# Altium schematic sheet 0179_EDP POWER GENERATI.SchDoc
size 848 x 558 mm
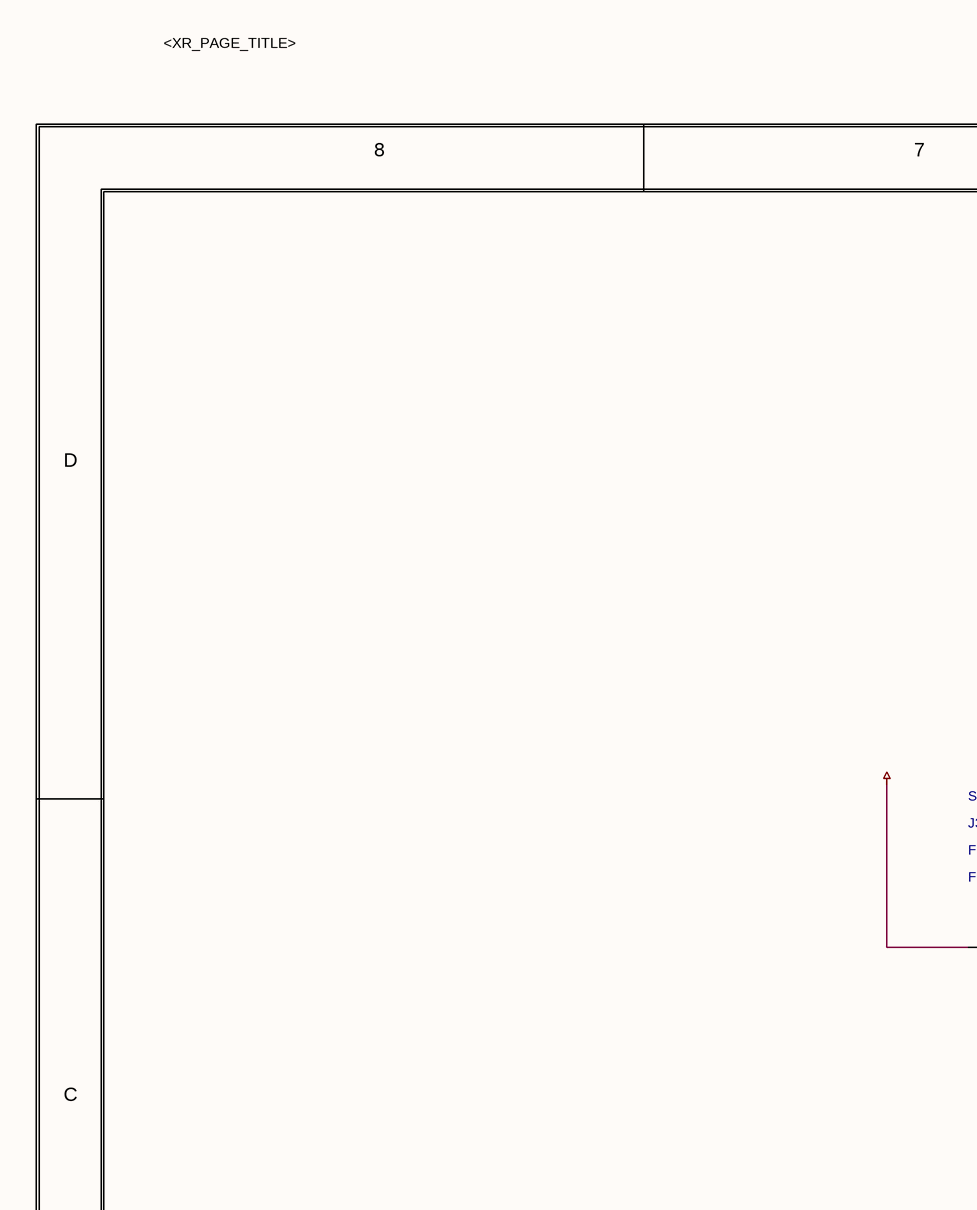
[diagram p0: 0179_EDP POWER GENERATI.SchDoc, top left]
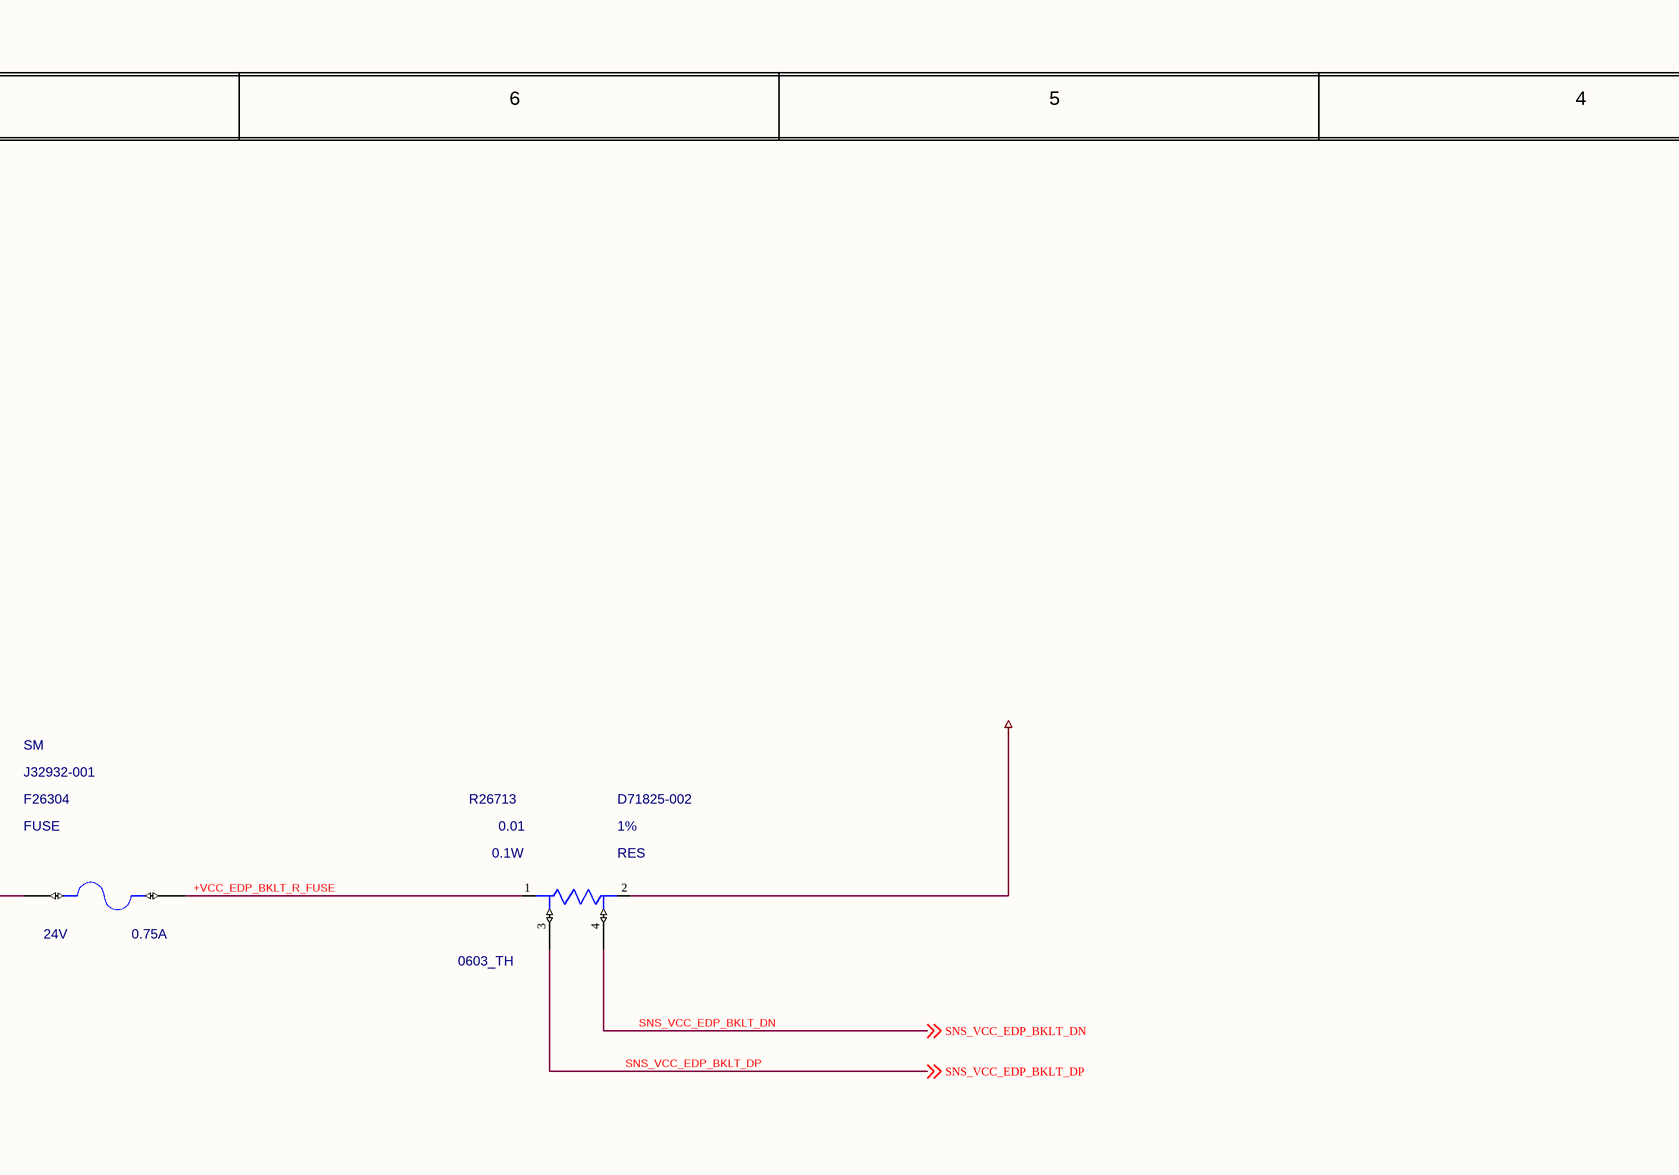
[diagram p1: 0179_EDP POWER GENERATI.SchDoc, top middle]
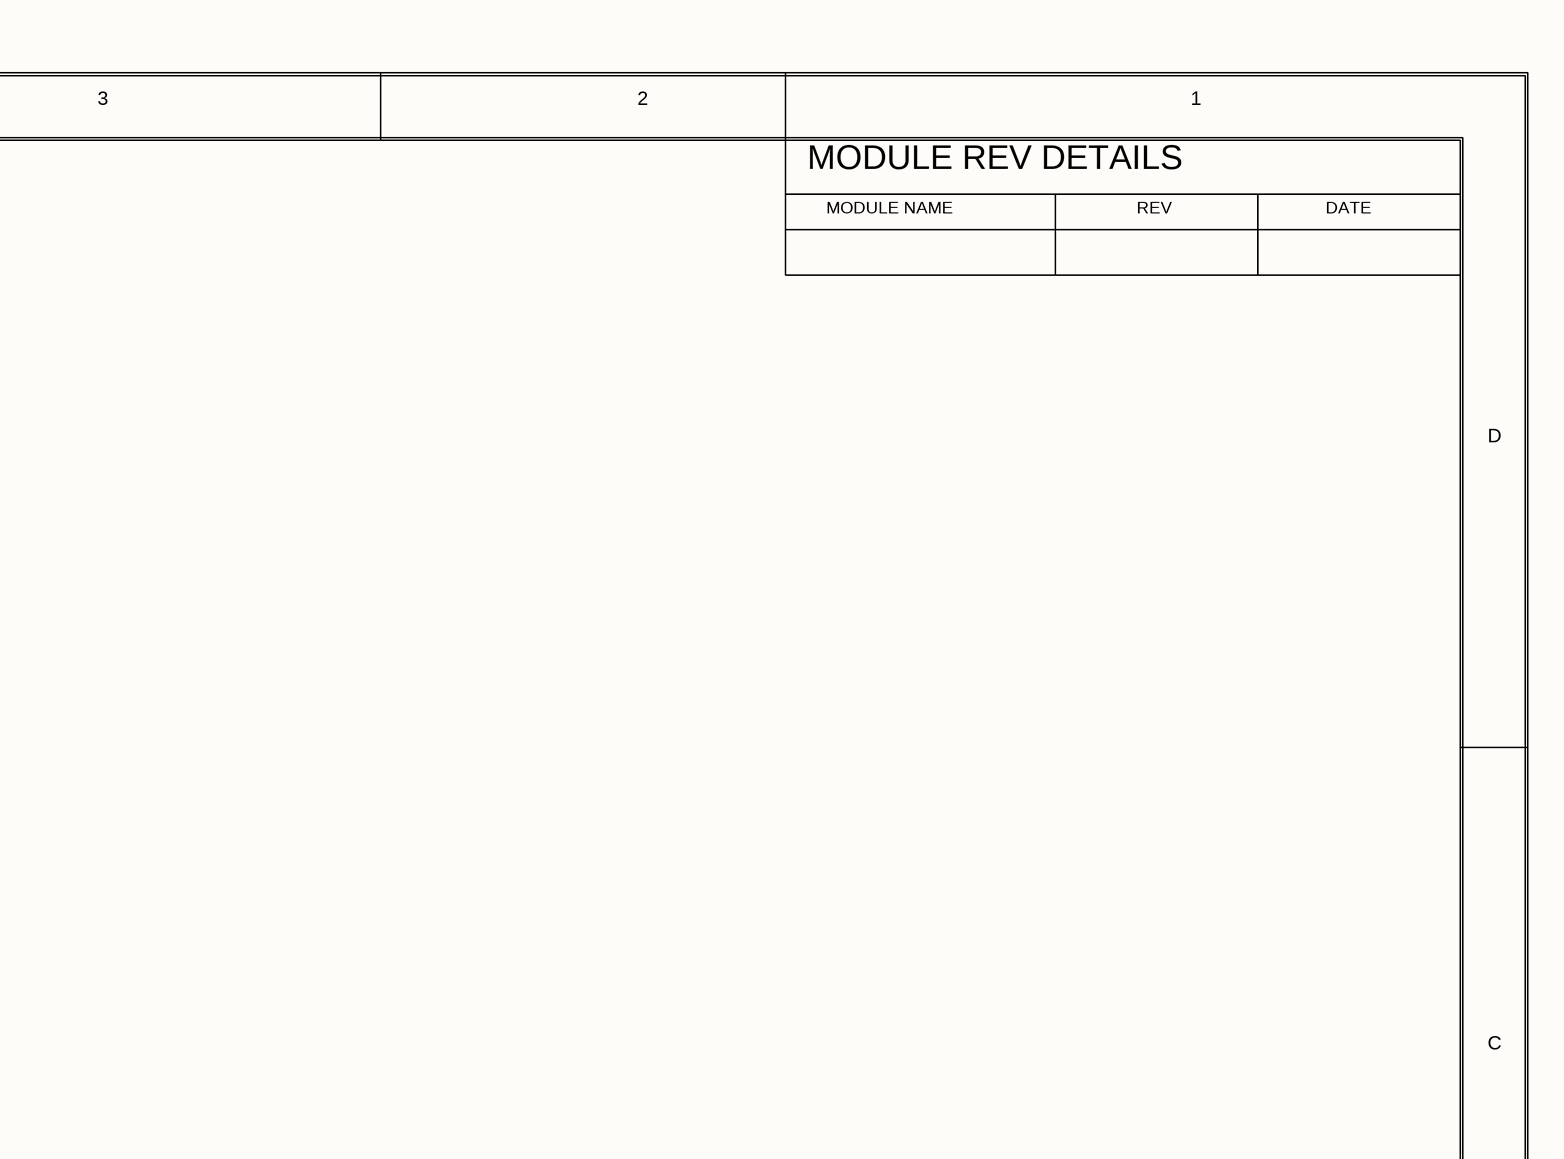
[diagram p2: 0179_EDP POWER GENERATI.SchDoc, top right]
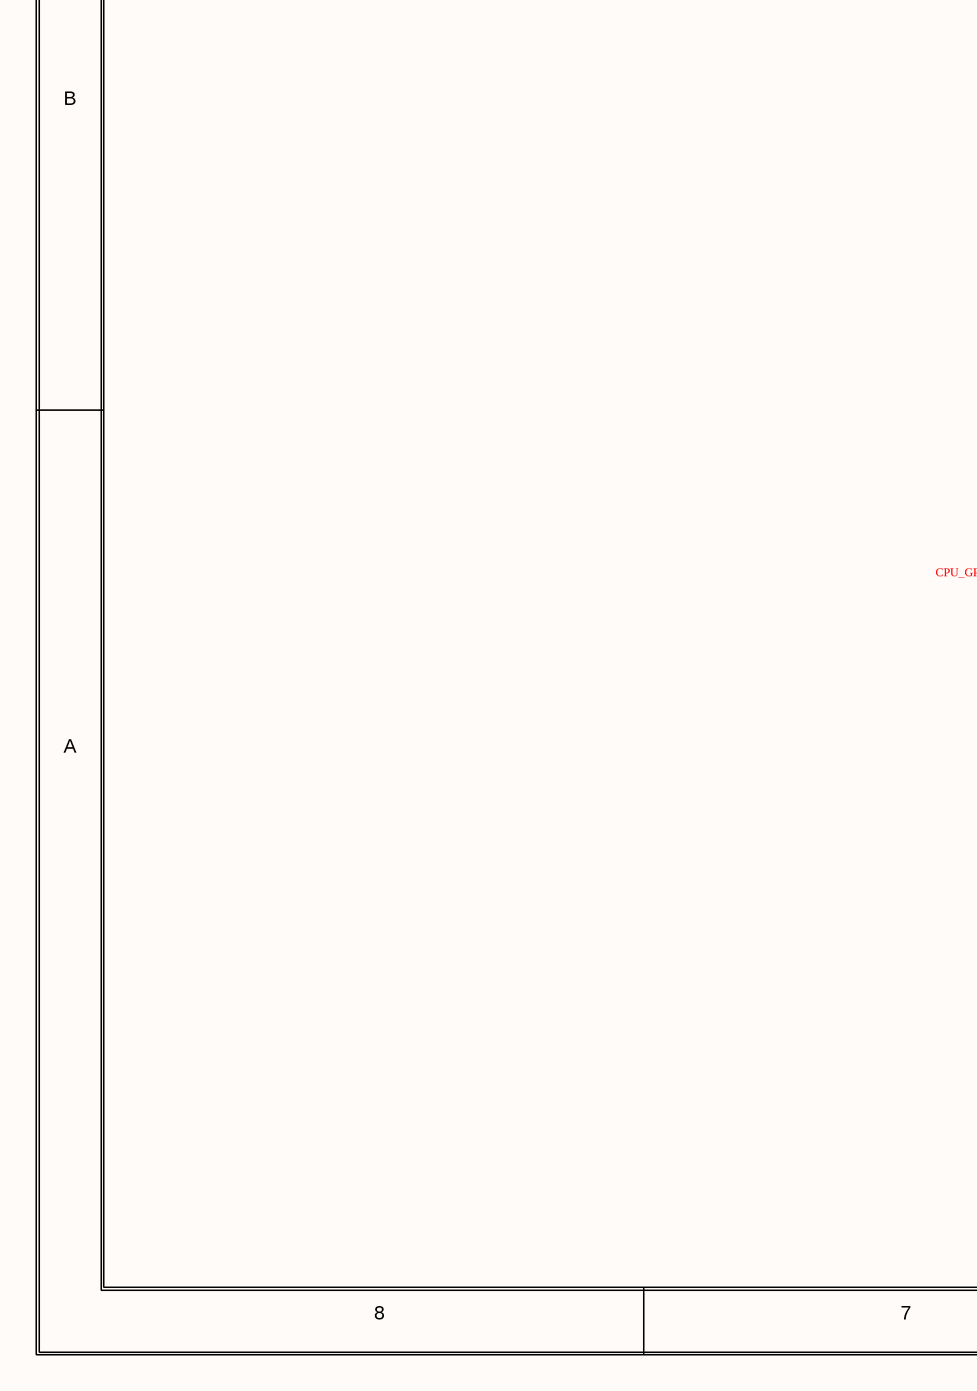
[diagram p3: 0179_EDP POWER GENERATI.SchDoc, bottom left]
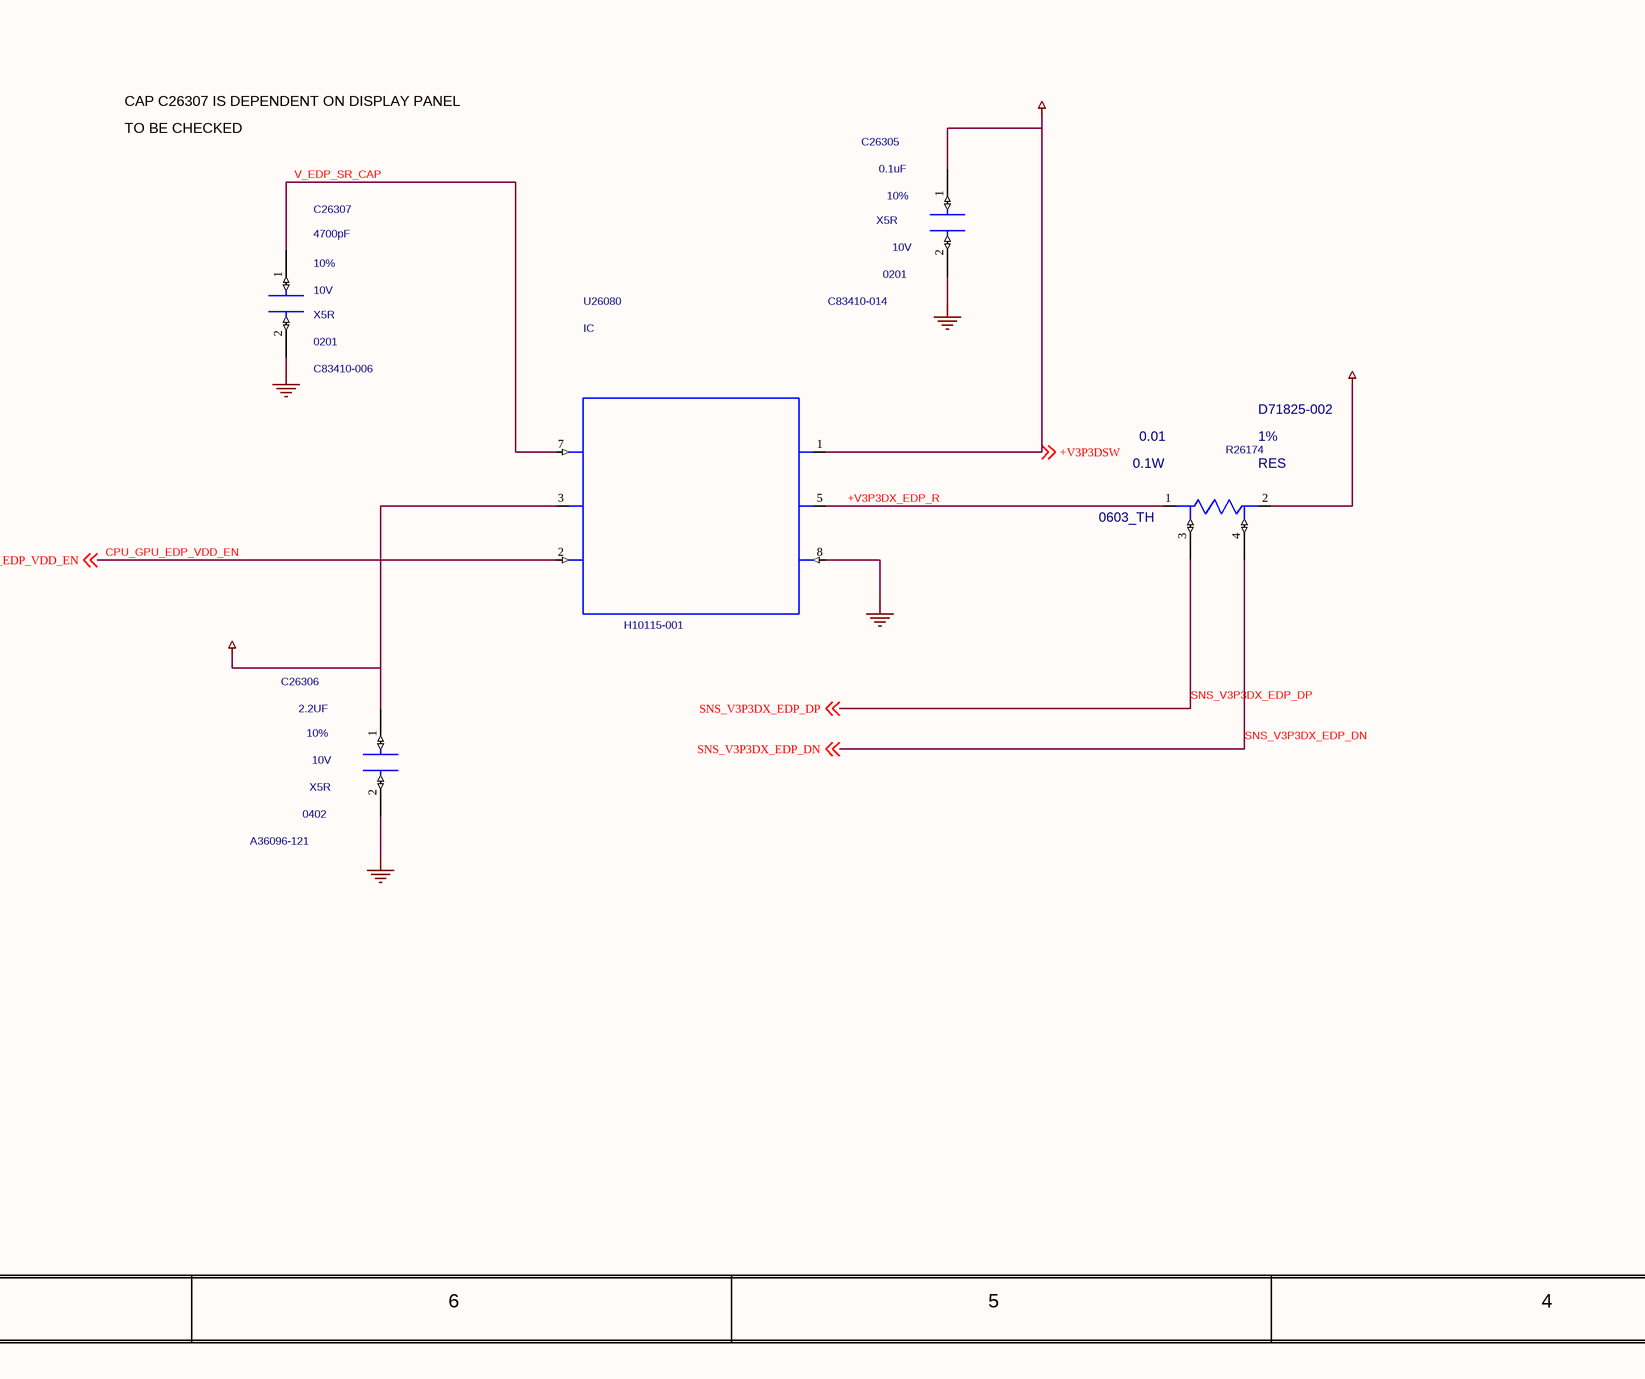
[diagram p4: 0179_EDP POWER GENERATI.SchDoc, bottom middle]
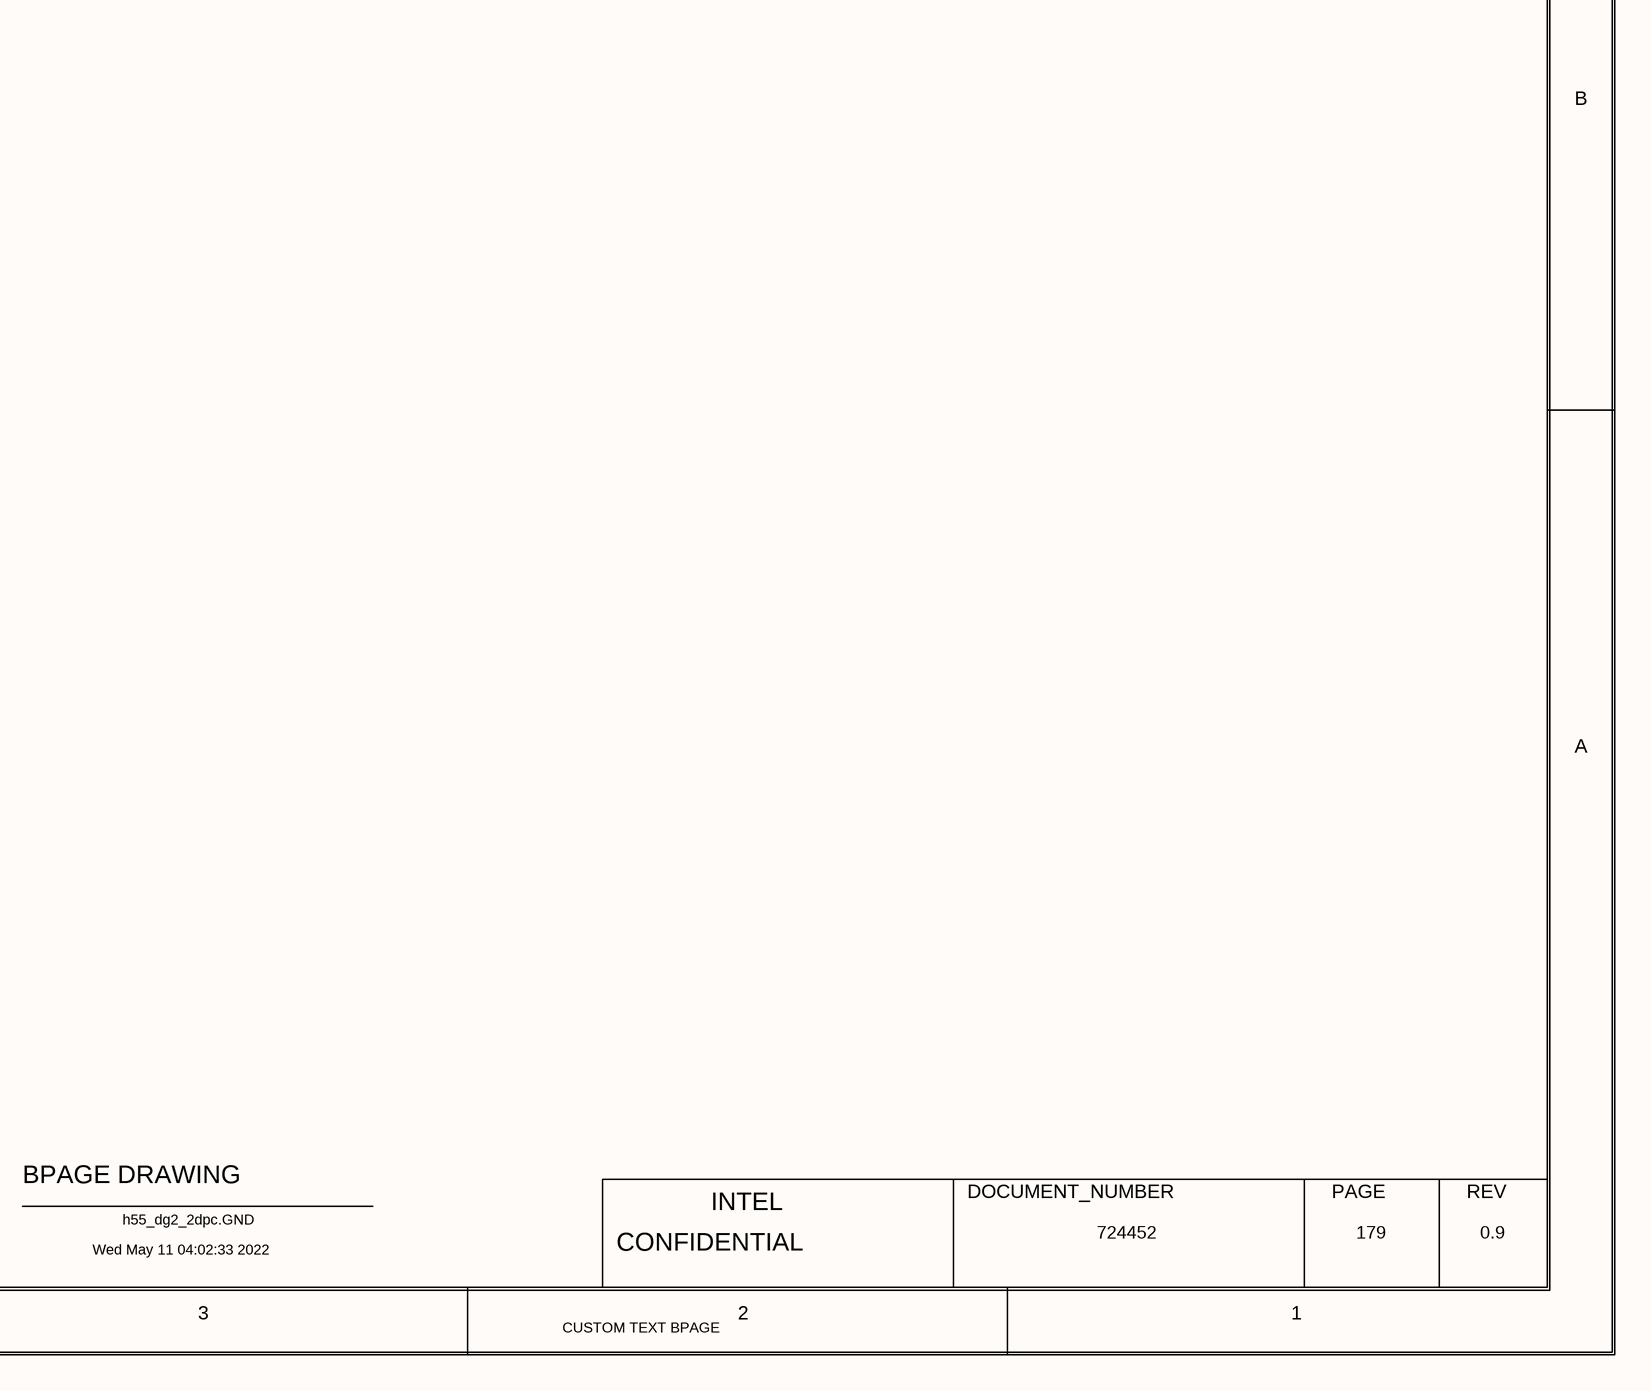
[diagram p5: 0179_EDP POWER GENERATI.SchDoc, bottom right]

## Parts
C26305  0.1uF  MATERIAL: X5R  PACK_TYPE: 0201  PART_NUMBER: C83410-014  TOLERANCE: 10%  VOLTAGE: 10V  [SMC0201IA]
C26306  2.2UF  MATERIAL: X5R  PACK_TYPE: 0402  PART_NUMBER: A36096-121  TOLERANCE: 10%  VOLTAGE: 10V  [SMC0402IA]
C26307  4700pF  MATERIAL: X5R  PACK_TYPE: 0201  PART_NUMBER: C83410-006  TOLERANCE: 10%  VOLTAGE: 10V  [SMC0201IA]
F26304  CURRENT: 0.75A  PACK_TYPE: SM  PART_NUMBER: J32932-001  VOLTAGE: 24V  [SFU3225MA]  (hidden comment: FUSE)
R26174  0.01  MATERIAL: RES  PACK_TYPE: 0603_TH  PART_NUMBER: D71825-002  TOLERANCE: 1%  WATTAGE: 0.1W  [CTK0_SMR4_0603_1800X1014_MA]
R26713  0.01  MATERIAL: RES  PACK_TYPE: 0603_TH  PART_NUMBER: D71825-002  TOLERANCE: 1%  WATTAGE: 0.1W  [CTK0_SMR4_0603_1800X1014_MA]
U26080  MATERIAL: IC  PART_NUMBER: H10115-001  [CTK1_LCC8_1050X1650_400_MA]  (hidden comment: C_SLG5NT1458V)

## Nets
+V3P3DSW: C26305.1(A) C26306.1(A) U26080.1(VDD) U26080.3(D) ; off-sheet +V3P3DSW
+V3P3DX_EDP: R26174.2(PWRB)
+VBATA: F26304.1(A)
+VCC_EDP_BKLT: R26713.2(PWRB)
GND: C26305.2(B) C26306.2(B) C26307.2(B) U26080.8(GND)
+V3P3DX_EDP_R: R26174.1(PWRA) U26080.5(S)
+VCC_EDP_BKLT_R_FUSE: F26304.2(B) R26713.1(PWRA)
CPU_GPU_EDP_VDD_EN: U26080.2(ON) ; off-sheet CPU_GPU_EDP_VDD_EN
SNS_V3P3DX_EDP_DN: R26174.4(SENB) ; off-sheet SNS_V3P3DX_EDP_DN
SNS_V3P3DX_EDP_DP: R26174.3(SENA) ; off-sheet SNS_V3P3DX_EDP_DP
SNS_VCC_EDP_BKLT_DN: R26713.4(SENB) ; off-sheet SNS_VCC_EDP_BKLT_DN
SNS_VCC_EDP_BKLT_DP: R26713.3(SENA) ; off-sheet SNS_VCC_EDP_BKLT_DP
V_EDP_SR_CAP: C26307.1(A) U26080.7(CAP)

## Notes on the sheet
- <XR_PAGE_TITLE>
- 8
- 7
- 6
- 5
- 4
- 3
- 2
- 1
- MODULE REV DETAILS
- MODULE NAME
- REV
- DATE
- D
- C
- B
- CAP C26307 IS DEPENDENT ON DISPLAY PANEL
- TO BE CHECKED
- A
- BPAGE DRAWING
- INTEL
- DOCUMENT_NUMBER
- PAGE
- Wed May 11 04:02:33 2022
- h55_dg2_2dpc.GND
- CONFIDENTIAL
- 724452
- 179
- 0.9
- CUSTOM TEXT BPAGE

## Library data of the parts
C26305 = CAP: CDS_PHYS_PART_NAME: CAP_0201-C83410-014,X5R,0.1UF,10V,10%,LPDB,GENERIC; OriginalSymbolOrigin: (-50,25); XY: (7700,1450); VER: 1; SUB_ROOM_2: DECOUPLING; SUB_ROOM_1: V3P3DX_EDP; ROT: 2; PHYS_PAGE: 179; LOCATION: C26305; DRAWING: @RVP1_ADL_SB_ADP_S_DDR5_SODIMM_2DPC_LIB.H55_DG2_2DPC(SCH_1):PAGE548; CDS_LIB: discrete; PCB Footprint: SMC0201IA; CHIPS_PART_NAME: CAP; CDS_PART_NAME: CAP_0201-C83410-014,X5R,0.1UF,10V,10%,LPDB,GENERIC; CDS_LOCATION: C26305
C26306 = CAP: CDS_PHYS_PART_NAME: CAP_0402-A36096-121,X5R,2.2UF,10V,10%,LPDB,GENERIC; OriginalSymbolOrigin: (-50,25); XY: (6650,450); VER: 1; SUB_ROOM_2: DECOUPLING; SUB_ROOM_1: V3P3DX_EDP; ROT: 2; PHYS_PAGE: 179; LOCATION: C26306; DRAWING: @RVP1_ADL_SB_ADP_S_DDR5_SODIMM_2DPC_LIB.H55_DG2_2DPC(SCH_1):PAGE548; CDS_LIB: discrete; PCB Footprint: SMC0402IA; CHIPS_PART_NAME: CAP; CDS_PART_NAME: CAP_0402-A36096-121,X5R,2.2UF,10V,10%,LPDB,GENERIC; CDS_LOCATION: C26306
C26307 = CAP: CDS_PHYS_PART_NAME: CAP_0201-C83410-006,X5R,4700PF,10V,10%,LPDB,GENERIC; OriginalSymbolOrigin: (-50,25); XY: (6475,1300); VER: 1; SUB_ROOM_2: MISC; SUB_ROOM_1: V3P3DX_EDP; ROT: 0; PHYS_PAGE: 179; LOCATION: C26307; DRAWING: @RVP1_ADL_SB_ADP_S_DDR5_SODIMM_2DPC_LIB.H55_DG2_2DPC(SCH_1):PAGE548; CDS_LIB: discrete; PCB Footprint: SMC0201IA; CHIPS_PART_NAME: CAP; CDS_PART_NAME: CAP_0201-C83410-006,X5R,4700PF,10V,10%,LPDB,GENERIC; CDS_LOCATION: C26307
F26304 = FUSE: CDS_PHYS_PART_NAME: FUSE_SM-J32932-001,FUSE,0.75A,24V,LPDB,GENERIC; CDS_LMAN_SYM_OUTLINE: -50,50,50,-50; OriginalSymbolOrigin: (-75,25); XY: (6050,3100); VER: 1; ROT: 0; PHYS_PAGE: 179; LOCATION: F26304; DRAWING: @RVP1_ADL_SB_ADP_S_DDR5_SODIMM_2DPC_LIB.H55_DG2_2DPC(SCH_1):PAGE548; CDS_LIB: discrete; MATERIAL: FUSE; PCB Footprint: SFU3225MA; CHIPS_PART_NAME: FUSE; CDS_PART_NAME: FUSE_SM-J32932-001,FUSE,0.75A,24V,LPDB,GENERIC; CDS_LOCATION: F26304
R26174 = C_RES_4TERM: CDS_PHYS_PART_NAME: C_RES_4TERM_0603_TH-D71825-002,RES,0.01,1%,0.1W,TK0,GENERIC; CDS_LMAN_SYM_OUTLINE: -50,50,50,-50; FP_TECH: TK0; IP: GENERIC; ROOM: NONE; OriginalSymbolOrigin: (-75,25); XY: (8200,925); VER: 1; ROT: 0; PHYS_PAGE: 179; LOCATION: R26174; DRAWING: @RVP1_ADL_SB_ADP_S_DDR5_SODIMM_2DPC_LIB.H55_DG2_2DPC(SCH_1):PAGE548; CDS_LIB: c_discrete; VARIANT: ?; PCB Footprint: CTK0_SMR4_0603_1800X1014_MA; CHIPS_PART_NAME: C_RES_4TERM; CDS_PART_NAME: C_RES_4TERM_0603_TH-D71825-002,RES,0.01,1%,0.1W,TK0,GENERIC; CDS_LOCATION: R26174
R26713 = C_RES_4TERM: CDS_PHYS_PART_NAME: C_RES_4TERM_0603_TH-D71825-002,RES,0.01,1%,0.1W,TK0,GENERIC; CDS_LMAN_SYM_OUTLINE: -50,50,50,-50; FP_TECH: TK0; IP: GENERIC; ROOM: NONE; OriginalSymbolOrigin: (-75,25); XY: (6925,3100); VER: 1; ROT: 0; PHYS_PAGE: 179; LOCATION: R26713; DRAWING: @RVP1_ADL_SB_ADP_S_DDR5_SODIMM_2DPC_LIB.H55_DG2_2DPC(SCH_1):PAGE548; CDS_LIB: c_discrete; VARIANT: ?; PCB Footprint: CTK0_SMR4_0603_1800X1014_MA; CHIPS_PART_NAME: C_RES_4TERM; CDS_PART_NAME: C_RES_4TERM_0603_TH-D71825-002,RES,0.01,1%,0.1W,TK0,GENERIC; CDS_LOCATION: R26713
U26080 = C_SLG5NT1458V: CDS_PHYS_PART_NAME: C_SLG5NT1458V_LCC-H10115-001,IC,SLG5NT1458V,TK1,GENERIC; CDS_LMAN_SYM_OUTLINE: -200,200,200,-200; FP_TECH: TK1; IP: GENERIC; PACK_TYPE: LCC; ROOM: NONE; OriginalSymbolOrigin: (-225,200); XY: (7225,925); VER: 1; ROT: 0; PHYS_PAGE: 179; LOCATION: U26080; DRAWING: @RVP1_ADL_SB_ADP_S_DDR5_SODIMM_2DPC_LIB.H55_DG2_2DPC(SCH_1):PAGE548; CDS_LIB: local; VARIANT: ?; PCB Footprint: CTK1_LCC8_1050X1650_400_MA; SEC_TYPE: LCC; CHIPS_PART_NAME: C_SLG5NT1458V; CDS_PART_NAME: C_SLG5NT1458V_LCC-H10115-001,IC,SLG5NT1458V,TK1,GENERIC; CDS_LOCATION: U26080